# Altium schematic sheet MCU_TSK80.SchDoc
size A; Organization: Altium Limited; Address1: L3, 12a Rodborough Rd; Address2: Frenchs Forest; Address3: NSW; Address4: Australia 2086; DocumentNumber: 3; SheetNumber: 3; SheetTotal: 5
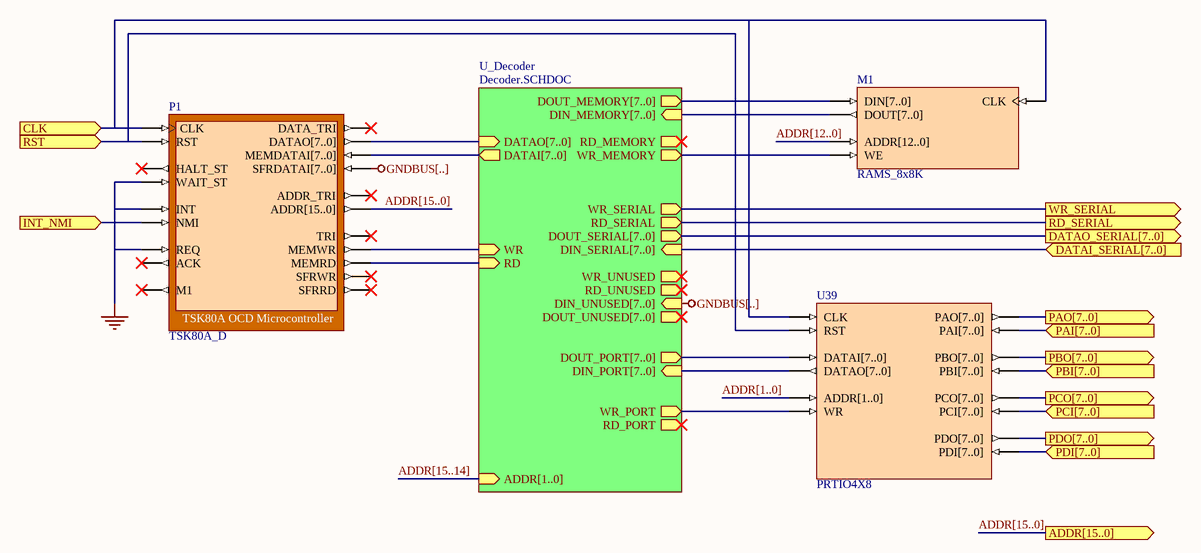
[diagram p0: MCU_TSK80.SchDoc]

## Parts
M1  RAMS_8x8K
P1  TSK80A_D
U39  PRTIO4X8

## Sub-sheets
U_Decoder = Decoder.SCHDOC: WR_MEMORY (out), WR_PORT (out), WR_SERIAL (out), WR_UNUSED (out), RD_MEMORY (out), RD_PORT (out), RD_SERIAL (out), RD_UNUSED (out), ADDR[1..0] (in), RD (in), WR (in), DIN_PORT[7..0] (in), DIN_SERIAL[7..0] (in), DIN_UNUSED[7..0] (in), DATAI[7..0] (out), DIN_MEMORY[7..0] (in), DOUT_MEMORY[7..0] (out), DOUT_PORT[7..0] (out), DOUT_UNUSED[7..0] (out), DOUT_SERIAL[7..0] (out), DATAO[7..0] (in)

## Ports
ADDR[15..0] (out), CLK (in), DATAI_SERIAL[7..0] (in), DATAO_SERIAL[7..0] (out), INT_NMI (in), PAI[7..0] (in), PAO[7..0] (out), PBI[7..0] (in), PBO[7..0] (out), PCI[7..0] (in), PCO[7..0] (out), PDI[7..0] (in), PDO[7..0] (out), RD_SERIAL (out), RST (in), WR_SERIAL (out)

## Nets
GND: P1.INT P1.REQ P1.WAIT_ST
GNDBUS[..]: P1.SFRDATAI[7..0] ; sheet U_Decoder/DIN_UNUSED[7..0]
ADDR[1..0]: U39.ADDR[1..0]
ADDR[12..0]: M1.ADDR[12..0]
ADDR[15..0]: P1.ADDR[15..0] ; port ADDR[15..0]
CLK: M1.CLK P1.CLK U39.CLK ; port CLK
INT_NMI: P1.NMI ; port INT_NMI
PAI[7..0]: U39.PAI[7..0] ; port PAI[7..0]
PAO[7..0]: U39.PAO[7..0] ; port PAO[7..0]
PBI[7..0]: U39.PBI[7..0] ; port PBI[7..0]
PBO[7..0]: U39.PBO[7..0] ; port PBO[7..0]
PCI[7..0]: U39.PCI[7..0] ; port PCI[7..0]
PCO[7..0]: U39.PCO[7..0] ; port PCO[7..0]
PDI[7..0]: U39.PDI[7..0] ; port PDI[7..0]
PDO[7..0]: U39.PDO[7..0] ; port PDO[7..0]
RD_SERIAL: port RD_SERIAL, sheet U_Decoder/RD_SERIAL
RST: P1.RST U39.RST ; port RST
WR_SERIAL: port WR_SERIAL, sheet U_Decoder/WR_SERIAL
NetM1_DIN[7..0]: M1.DIN[7..0] ; sheet U_Decoder/DOUT_MEMORY[7..0]
NetM1_DOUT[7..0]: M1.DOUT[7..0] ; sheet U_Decoder/DIN_MEMORY[7..0]
NetM1_WE: M1.WE ; sheet U_Decoder/WR_MEMORY
NetP1_DATAO[7..0]: P1.DATAO[7..0] ; sheet U_Decoder/DATAO[7..0]
NetP1_MEMDATAI[7..0]: P1.MEMDATAI[7..0] ; sheet U_Decoder/DATAI[7..0]
NetP1_MEMRD: P1.MEMRD ; sheet U_Decoder/RD
NetP1_MEMWR: P1.MEMWR ; sheet U_Decoder/WR
NetU39_DATAI[7..0]: U39.DATAI[7..0] ; sheet U_Decoder/DOUT_PORT[7..0]
NetU39_DATAO[7..0]: U39.DATAO[7..0] ; sheet U_Decoder/DIN_PORT[7..0]
NetU39_WR: U39.WR ; sheet U_Decoder/WR_PORT

Not connected (* = marked no-connect by the designer): P1 ACK* ADDR_TRI* DATA_TRI* HALT_ST* M1* SFRRD* SFRWR* TRI*

## Buses and harness runs
bus ADDR[1..0]
bus ADDR[12..0]
bus ADDR[15..0]
bus ADDR[15..0] = port ADDR[15..0]
bus ADDR[15..14] = sheet U_Decoder/ADDR[1..0]
bus port DATAI_SERIAL[7..0] = sheet U_Decoder/DIN_SERIAL[7..0]
bus port DATAO_SERIAL[7..0] = sheet U_Decoder/DOUT_SERIAL[7..0]

## Notes on the sheet
- Labels drawn without touching a wire or pin: GNDBUS[..]
- Title
- Size:
- Date:
- A
- Number:
- Time:
- Revision:
- Sheet
- of
- File:

## Library data of the parts
M1 = RAMS_8x8K: Single Port Random Access Memory; Memory_Depth: 8192; Memory_Type: RAM_SinglePortBlock; Memory_Width: 8; Memory_ClockEdge: Rising; Nexus_Core: Memory_Program; Published: 13/01/2004; Publisher: Altium Hobart Technology Center
P1 = TSK80A_D: TSK80A OCD Microcontroller; ChildCore1: M1; NEXUS_CORE: Processor_OCDS; NEXUS_JTAG_DEVICE: True; NEXUS_JTAG_ORDER: 0; Memory_Configuration: Record[NEXUS_CORE]{}ComponentDesignator[xrom]{}Memory_Depth[4K]{}Memory_UsageType[rom]{}ProgramDownloadAddress[0x0]{}Memory_BusType[cz80:mem_bus]{n}Record[NEXUS_CORE]{}ComponentDesignator[xram]{}Memory_Depth[4K]{}Memory_UsageType[ram]{}ProgramDownloadAddress[4k]{}Memory_BusType[cz80:mem_bus]{n}Record[NEXUS_CORE]{}ComponentDesignator[sfr]{}Memory_Depth[64k]{}Memory_UsageType[ram]{}ProgramDownloadAddress[0x0]{}Memory_BusType[cz80:sfr_bus]{n}Record[NEXUS_CORE]{}ComponentDesignator[Ports]{}Memory_Depth[8]{}Memory_UsageType[ram]{}ProgramDownloadAddress[0x4000]{}Memory_BusType[cz80:mem_bus]{n}Record[NEXUS_CORE]{}ComponentDesignator[Serial]{}Memory_Depth[16]{}Memory_UsageType[ram]{}ProgramDownloadAddress[0x8000]{}Memory_BusType[cz80:mem_bus]{n}; Published: 7/01/2004; Publisher: Altium Hobart Technology Centre; Core Revision: 1.00.00
U39 = PRTIO4X8: Port IO 4 x 8; Published: 29/01/2004; Publisher: Altium Hobart Technology Centre; Core Revision: 1.00.00